# Altium schematic sheet opto_io.schdoc
size A4
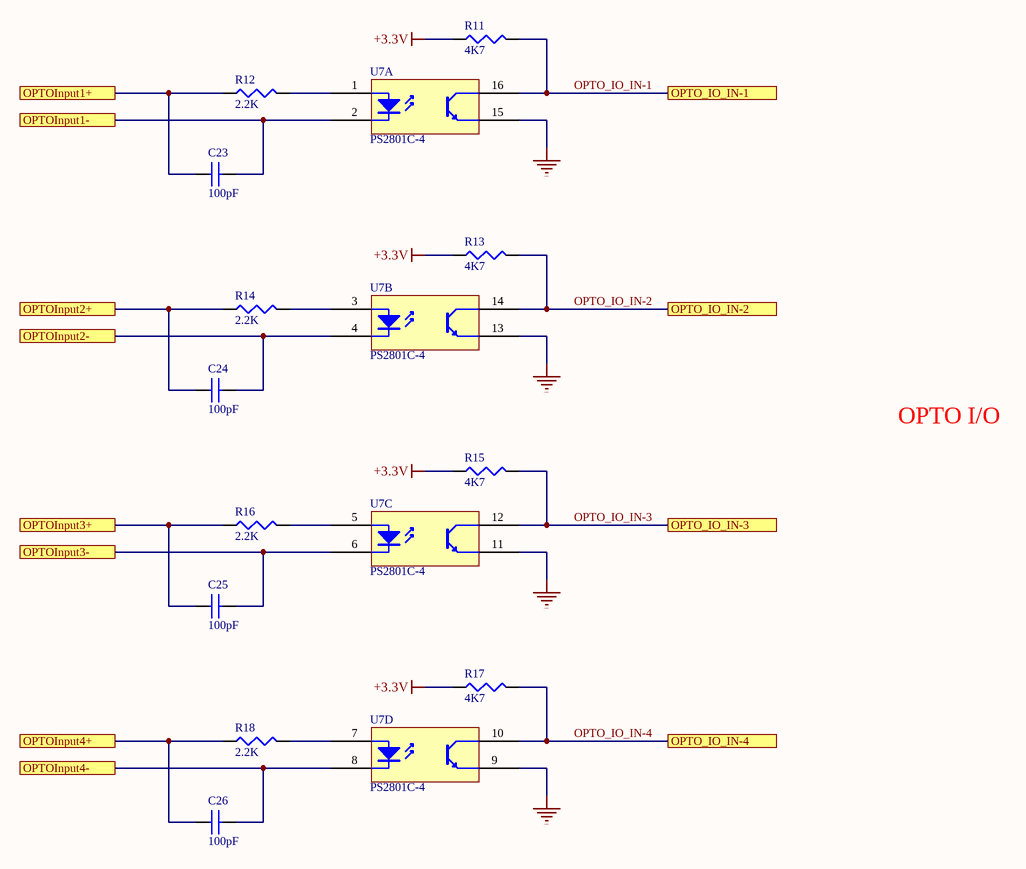
[diagram p0: opto_io.schdoc]

## Parts
C23  value 100pF  [0805 SMD Ceramic Capacitor]  (hidden comment: C0805C101)
C24  value 100pF  [0805 SMD Ceramic Capacitor]  (hidden comment: C0805C101)
C25  value 100pF  [0805 SMD Ceramic Capacitor]  (hidden comment: C0805C101)
C26  value 100pF  [0805 SMD Ceramic Capacitor]  (hidden comment: C0805C101)
R11  value 4K7  [0805 Resistor]  (hidden comment: 0805_4K7%1)
R12  value 2.2K  [0805 Resistor]  (hidden comment: 0805_1K)
R13  value 4K7  [0805 Resistor]  (hidden comment: 0805_4K7%1)
R14  value 2.2K  [0805 Resistor]  (hidden comment: 0805_1K)
R15  value 4K7  [0805 Resistor]  (hidden comment: 0805_4K7%1)
R16  value 2.2K  [0805 Resistor]  (hidden comment: 0805_1K)
R17  value 4K7  [0805 Resistor]  (hidden comment: 0805_4K7%1)
R18  value 2.2K  [0805 Resistor]  (hidden comment: 0805_1K)
U7  value PS2801C-4  [SO16]  (hidden comment: PS2801C-4_Discrete)  (parts A,B,C,D of 4)

## Ports
OPTO_IO_IN-1, OPTO_IO_IN-2, OPTO_IO_IN-3, OPTO_IO_IN-4, OPTOInput1+, OPTOInput1-, OPTOInput2+, OPTOInput2-, OPTOInput3+, OPTOInput3-, OPTOInput4+, OPTOInput4-

## Nets
+3.3V: R11.1 R13.1 R15.1 R17.1
GND: U7.9 U7.11 U7.13 U7.15
OPTO_IO_IN-1: R11.2 U7.16 ; port OPTO_IO_IN-1
OPTO_IO_IN-2: R13.2 U7.14 ; port OPTO_IO_IN-2
OPTO_IO_IN-3: R15.2 U7.12 ; port OPTO_IO_IN-3
OPTO_IO_IN-4: R17.2 U7.10 ; port OPTO_IO_IN-4
OPTOInput1+: C23.1 R12.1 ; port OPTOInput1+
OPTOInput1-: C23.2 U7.2 ; port OPTOInput1-
OPTOInput2+: C24.1 R14.1 ; port OPTOInput2+
OPTOInput2-: C24.2 U7.4 ; port OPTOInput2-
OPTOInput3+: C25.1 R16.1 ; port OPTOInput3+
OPTOInput3-: C25.2 U7.6 ; port OPTOInput3-
OPTOInput4+: C26.1 R18.1 ; port OPTOInput4+
OPTOInput4-: C26.2 U7.8 ; port OPTOInput4-
NetR12_2: R12.2 U7.1
NetR14_2: R14.2 U7.3
NetR16_2: R16.2 U7.5
NetR18_2: R18.2 U7.7

## Notes on the sheet
- OPTO I/O

## Library data of the parts
C23-C26 = C0805C101: Manufacturer: MURATA Electronics; Manufacturer Code: GRM21A5C2E101JW01D; Voltage: 250V; Tolerance: ±5%; Unit Price: 0,33 $; Package: 0805
R11 R13 R15 R17 = 0805_4K7%1: Manufacturer Code: PCF0805P-R-4K7-BT1; Manufacturer: WELWYN; Tolerance: ±0.1%; Temperature Coefficient: ±25ppm/°C; Power Rating: 100mW; Unit Price: 0,34; Farnell Code: 1506096; MOQ: 5
R12 R14 R16 R18 = 0805_1K: Manufacturer Code: MC01W080511K; Manufacturer: MULTICOMP; Tolerance: ±1%; Farnell Code: 9332383; Unit Price: 0,03 €
U7 = PS2801C-4_Discrete: Manufacturer Code: PS2801C-4-F3-A; Manufacturer: NEC; Input Current: 5mA; Farnell Code: 1682862; Unit Price: 1,37 €